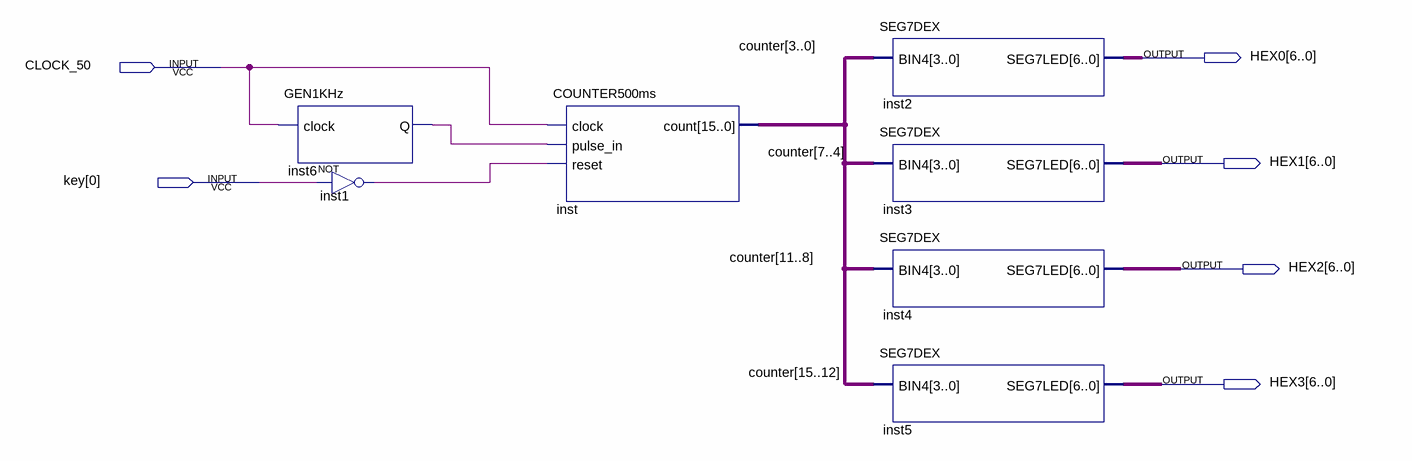
[diagram p0: schematic sheet]
// Quartus schematic test_count..bdf as structural Verilog: 7 symbols, 6 pins
module \test_count.  (
  input  CLOCK_50,
  input  [0:0] key,
  output [6:0] HEX0,
  output [6:0] HEX1,
  output [6:0] HEX2,
  output [6:0] HEX3
);

  wire inst1_out, inst6_q;
  wire [15:0] counter;

  GEN1KHz inst6 (.clock(CLOCK_50), .Q(inst6_q));
  not inst1 (inst1_out, key[0]);
  COUNTER500ms inst (.clock(CLOCK_50), .pulse_in(inst6_q), .reset(inst1_out), .count(counter));
  SEG7DEX inst2 (.BIN4(counter[3:0]), .SEG7LED(HEX0));
  SEG7DEX inst3 (.BIN4(counter[7:4]), .SEG7LED(HEX1));
  SEG7DEX inst4 (.BIN4(counter[11:8]), .SEG7LED(HEX2));
  SEG7DEX inst5 (.BIN4(counter[15:12]), .SEG7LED(HEX3));
endmodule
